# Altium schematic sheet HDMI_Schematic.SchDoc
size A2; SheetNumber: 4; SheetTotal: 5
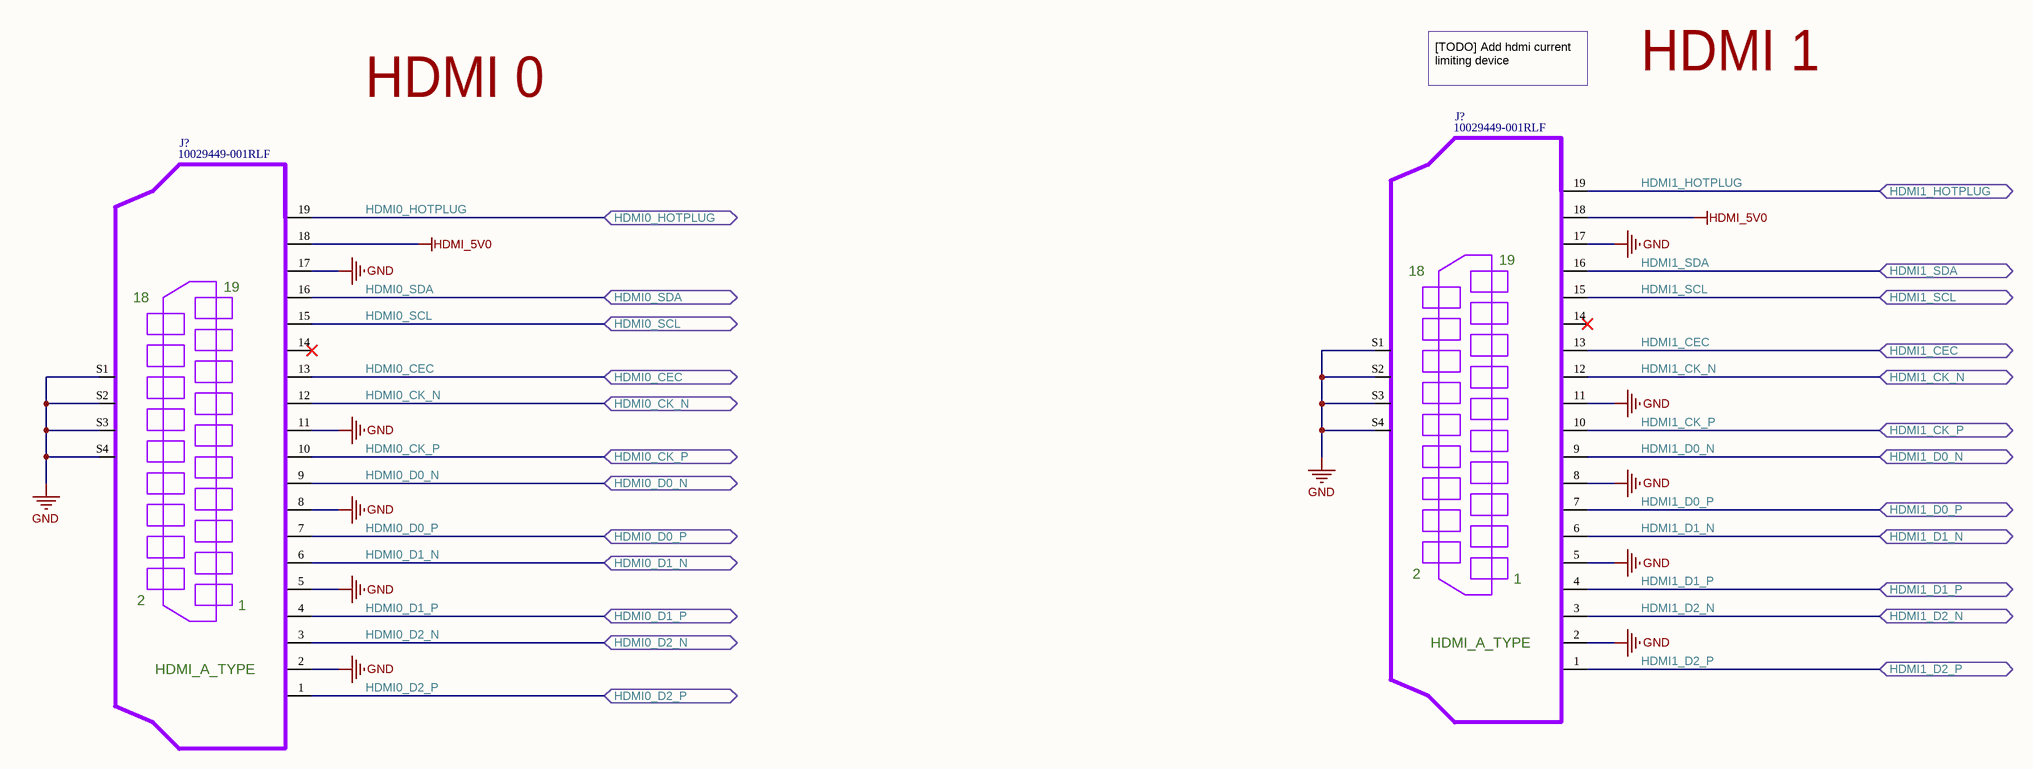
[diagram p0: HDMI_Schematic.SchDoc]

## Parts
(Parts that share a designator on the sheet are numbered #1, #2 ... from top to bottom, then left to right.)
J?#1  10029449-001RLF  [AMPHENOL_10029449-001RLF_HDMI]
J?#2  10029449-001RLF  [AMPHENOL_10029449-001RLF_HDMI]

## Ports
HDMI0_CEC (bidir), HDMI0_CK_N (bidir), HDMI0_CK_P (bidir), HDMI0_D0_N (bidir), HDMI0_D0_P (bidir), HDMI0_D1_N (bidir), HDMI0_D1_P (bidir), HDMI0_D2_N (bidir), HDMI0_D2_P (bidir), HDMI0_HOTPLUG (bidir), HDMI0_SCL (bidir), HDMI0_SDA (bidir), HDMI1_CEC (bidir), HDMI1_CK_N (bidir), HDMI1_CK_P (bidir), HDMI1_D0_N (bidir), HDMI1_D0_P (bidir), HDMI1_D1_N (bidir), HDMI1_D1_P (bidir), HDMI1_D2_N (bidir), HDMI1_D2_P (bidir), HDMI1_HOTPLUG (bidir), HDMI1_SCL (bidir), HDMI1_SDA (bidir)

## Nets
GND: J?#1.2 J?#1.5 J?#1.8 J?#1.11 J?#1.17 J?#1.S1 J?#1.S2 J?#1.S3 J?#1.S4 J?#2.2 J?#2.5 J?#2.8 J?#2.11 J?#2.17 J?#2.S1 J?#2.S2 J?#2.S3 J?#2.S4
HDMI_5V0: J?#1.18 J?#2.18
HDMI0_CEC: J?#2.13 ; port HDMI0_CEC
HDMI0_CK_N: J?#2.12 ; port HDMI0_CK_N
HDMI0_CK_P: J?#2.10 ; port HDMI0_CK_P
HDMI0_D0_N: J?#2.9 ; port HDMI0_D0_N
HDMI0_D0_P: J?#2.7 ; port HDMI0_D0_P
HDMI0_D1_N: J?#2.6 ; port HDMI0_D1_N
HDMI0_D1_P: J?#2.4 ; port HDMI0_D1_P
HDMI0_D2_N: J?#2.3 ; port HDMI0_D2_N
HDMI0_D2_P: J?#2.1 ; port HDMI0_D2_P
HDMI0_HOTPLUG: J?#2.19 ; port HDMI0_HOTPLUG
HDMI0_SCL: J?#2.15 ; port HDMI0_SCL
HDMI0_SDA: J?#2.16 ; port HDMI0_SDA
HDMI1_CEC: J?#1.13 ; port HDMI1_CEC
HDMI1_CK_N: J?#1.12 ; port HDMI1_CK_N
HDMI1_CK_P: J?#1.10 ; port HDMI1_CK_P
HDMI1_D0_N: J?#1.9 ; port HDMI1_D0_N
HDMI1_D0_P: J?#1.7 ; port HDMI1_D0_P
HDMI1_D1_N: J?#1.6 ; port HDMI1_D1_N
HDMI1_D1_P: J?#1.4 ; port HDMI1_D1_P
HDMI1_D2_N: J?#1.3 ; port HDMI1_D2_N
HDMI1_D2_P: J?#1.1 ; port HDMI1_D2_P
HDMI1_HOTPLUG: J?#1.19 ; port HDMI1_HOTPLUG
HDMI1_SCL: J?#1.15 ; port HDMI1_SCL
HDMI1_SDA: J?#1.16 ; port HDMI1_SDA

Not connected (* = marked no-connect by the designer): J?#1 14*; J?#2 14*

## Notes on the sheet
- HDMI 0
- [TODO] Add hdmi current limiting device
- HDMI 1
- (in symbol 10029449-001RLF) HDMI_A_TYPE

## Library data of the parts
J?#1 J?#2 = 10029449-001RLF: HDMI, Displayport & DVI Connectors TYPE A RECEPTACLE; Manufacturer: Amphenol FCI; MinTemp: - 55 C; MaxTemp: + 85 C; ManufacturerPartNumber: 10029449-001RLF; SupplierPartNumber: 649-10029449-001RLF; Supplier: Mouser; PartStatus: Active; Price: 176.25(INR); ComponentLink1Description: SupplierURL; ComponentLink1URL: https://www.mouser.in/ProductDetail/Amphenol-FCI/10029449-001RLF?qs=D%252By4jQJzx8L60NhBOOKSqQ%3D%3D